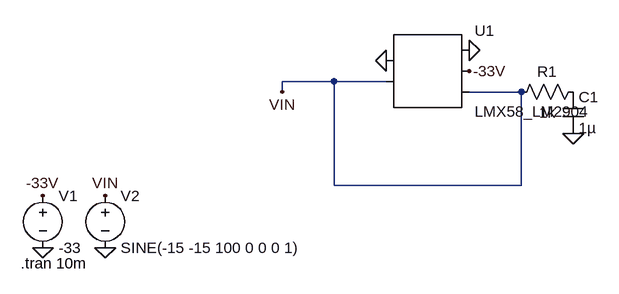
[diagram p0: schematic Draft1.asc]
* Draft1.asc
* U1: LMX58_LM2904 (symbol AutoGenerated\LMX58_LM2904 not available, pins judged from their places): pin1=0 pin2=VIN pin3=0 pin4=-33V pin5=VIN
R1 P001 VIN 1k
V1 -33V 0 -33
V2 VIN 0 SINE(-15 -15 100 0 0 0 1)
C1 P001 0 1µ
.tran 10m
.backanno
.end

* Results of the author's LTspice run, read from the files saved beside the schematic
* Operating Point, zero values left out:
*   V(vin) = -15 V
*   V(-33v) = -33 V
*   V(p001) = -15 V
*   I(V2) = 40 mA
*   I(V1) = 350 µA
*   Ix(u1:IN+) = -19.98 nA
*   Ix(u1:IN-) = -18 nA
*   Ix(u1:VCC) = 40.35 mA
*   Ix(u1:VEE) = -350 µA
*   Ix(u1:OUT) = -40 mA
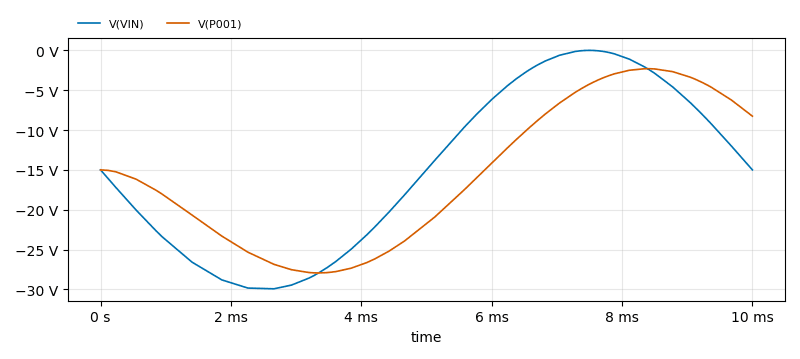
[diagram p1: Transient Analysis of Draft1.asc, plotted from the saved traces]
* Transient Analysis, 1 run:
*   V(VIN): min -29.92 V, max -6.793 µV, average -14.99 V, rms 18.37 V, last -15 V
*   V(P001): min -27.93 V, max -2.303 V, average -15.67 V, rms 18.12 V, last -8.258 V